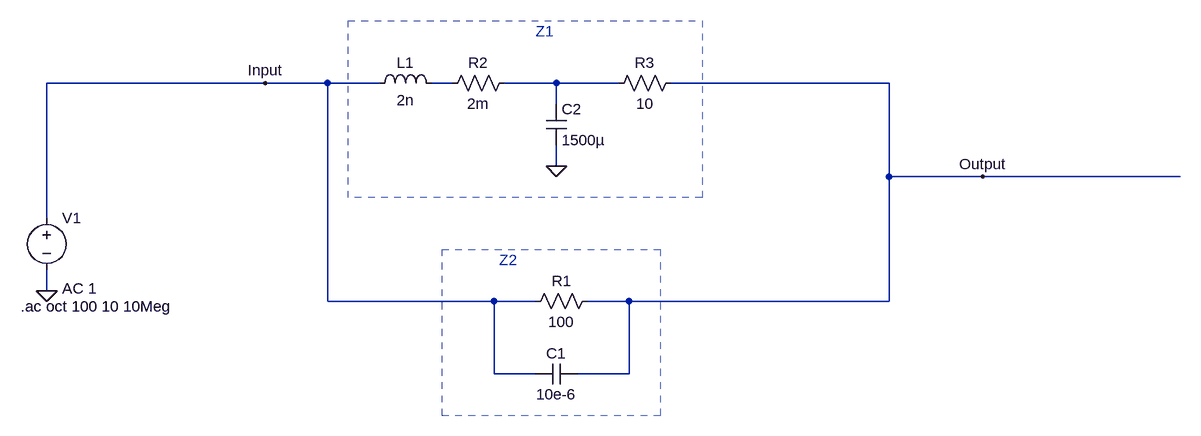
[diagram p0: schematic Comp_For_PDN.asc]
Comp_For_PDN.asc, the LTspice schematic file:
Version 4
SHEET 1 1652 680
WIRE 240 -96 -96 -96
WIRE 336 -96 240 -96
WIRE 416 -96 336 -96
WIRE 528 -96 496 -96
WIRE 688 -96 608 -96
WIRE 784 -96 688 -96
WIRE 1200 -96 864 -96
WIRE 688 -64 688 -96
WIRE 688 32 688 0
WIRE 1200 48 1200 -96
WIRE 1344 48 1200 48
WIRE 1648 48 1344 48
WIRE -96 112 -96 -96
WIRE -96 224 -96 192
WIRE 336 240 336 -96
WIRE 592 240 336 240
WIRE 656 240 592 240
WIRE 800 240 736 240
WIRE 1200 240 1200 48
WIRE 1200 240 800 240
WIRE 592 352 592 240
WIRE 656 352 592 352
WIRE 800 352 800 240
WIRE 800 352 720 352
FLAG -96 224 0
FLAG 688 32 0
FLAG 240 -96 Input
FLAG 1344 48 Output
SYMBOL voltage -96 96 R0
WINDOW 123 24 124 Left 2
WINDOW 39 0 0 Left 0
SYMATTR Value2 AC 1
SYMATTR InstName V1
SYMATTR Value ""
SYMBOL res 752 224 R90
WINDOW 0 0 56 VBottom 2
WINDOW 3 32 56 VTop 2
SYMATTR InstName R1
SYMATTR Value 100
SYMBOL cap 720 336 R90
WINDOW 0 0 32 VBottom 2
WINDOW 3 32 32 VTop 2
SYMATTR InstName C1
SYMATTR Value 10e-6
SYMBOL ind 400 -80 R270
WINDOW 0 32 56 VTop 2
WINDOW 3 5 56 VBottom 2
SYMATTR InstName L1
SYMATTR Value 2n
SYMBOL res 624 -112 R90
WINDOW 0 0 56 VBottom 2
WINDOW 3 32 56 VTop 2
SYMATTR InstName R2
SYMATTR Value 2m
SYMBOL cap 672 -64 R0
SYMATTR InstName C2
SYMATTR Value 1500µ
SYMBOL res 880 -112 R90
WINDOW 0 0 56 VBottom 2
WINDOW 3 32 56 VTop 2
SYMATTR InstName R3
SYMATTR Value 10
TEXT -136 248 Left 2 !.ac oct 100 10 10Meg
TEXT 656 -176 Left 2 ;Z1
TEXT 600 176 Left 2 ;Z2
RECTANGLE Normal 912 80 368 -192 2
RECTANGLE Normal 848 416 512 160 2

The netlist it stands for:
* Comp_For_PDN.asc
V1 Input 0 AC 1
R1 Output Input 100
C1 Output Input 10e-6
L1 Input N001 2n
R2 N002 N001 2m
C2 N002 0 1500µ
R3 Output N002 10
.ac oct 100 10 10Meg
* Z1
* Z2
.backanno
.end